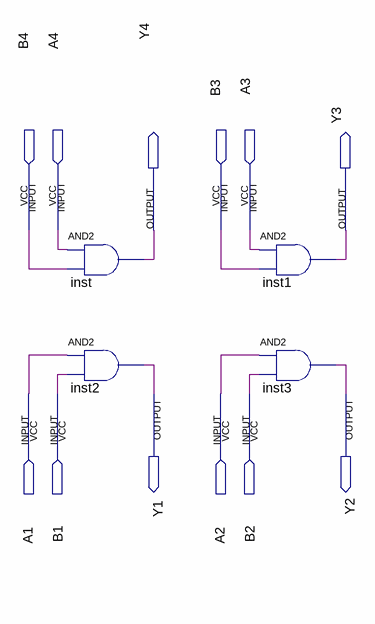
[diagram p0: schematic sheet]
// Quartus schematic ci7408.bdf as structural Verilog: 4 symbols, 12 pins
module ci7408 (
  input  B4,
  input  A4,
  input  B3,
  input  A3,
  input  A1,
  input  B1,
  input  A2,
  input  B2,
  output Y4,
  output Y3,
  output Y1,
  output Y2
);

  and inst (Y4, A4, B4);
  and inst2 (Y1, A1, B1);
  and inst1 (Y3, A3, B3);
  and inst3 (Y2, A2, B2);
endmodule
